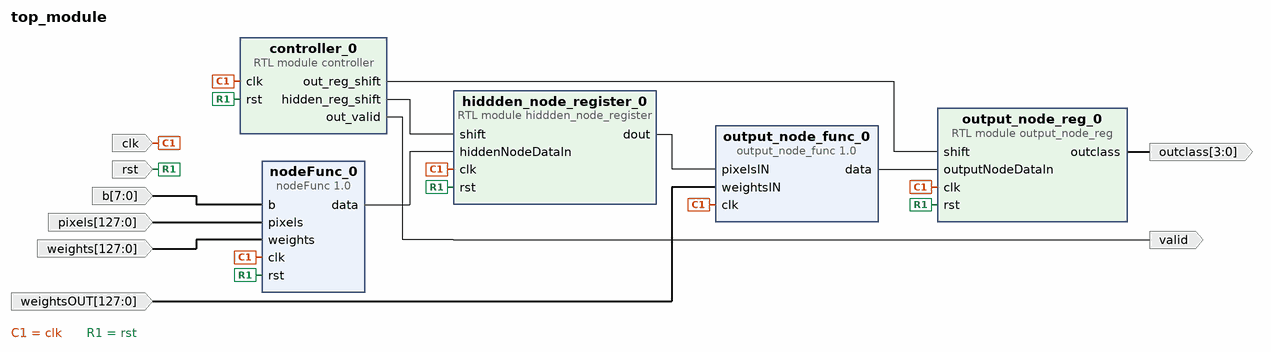
[diagram p0: block diagram of the top level]
# Vivado block design top_module, xc7a35tcpg236-1, Vivado 2022.2
create_bd_design top_module

create_bd_port -dir I -type clk clk
create_bd_port -dir I -type rst rst
create_bd_port -dir I -from 127 -to 0 weights
create_bd_port -dir I -from 127 -to 0 weightsOUT
create_bd_port -dir O valid
create_bd_port -dir O -from 3 -to 0 outclass
create_bd_port -dir I -from 7 -to 0 b
create_bd_port -dir I -from 127 -to 0 pixels

create_bd_cell -type ip -vlnv xilinx.com:user:nodeFunc:1.0 nodeFunc_0
create_bd_cell -type ip -vlnv xilinx.com:user:output_node_func:1.0 output_node_func_0
create_bd_cell -type module -reference controller controller_0
create_bd_cell -type module -reference hiddden_node_register hiddden_node_register_0
create_bd_cell -type module -reference output_node_reg output_node_reg_0

# ---- connections ----

connect_bd_net [get_bd_ports b] [get_bd_pins nodeFunc_0/b]
connect_bd_net -net clk_0_1 [get_bd_ports clk] \
  [get_bd_pins nodeFunc_0/clk] [get_bd_pins output_node_func_0/clk] [get_bd_pins controller_0/clk] \
  [get_bd_pins hiddden_node_register_0/clk] [get_bd_pins output_node_reg_0/clk]
connect_bd_net [get_bd_pins controller_0/hidden_reg_shift] [get_bd_pins hiddden_node_register_0/shift]
connect_bd_net [get_bd_pins controller_0/out_reg_shift] [get_bd_pins output_node_reg_0/shift]
connect_bd_net [get_bd_pins controller_0/out_valid] [get_bd_ports valid]
connect_bd_net [get_bd_pins hiddden_node_register_0/dout] [get_bd_pins output_node_func_0/pixelsIN]
connect_bd_net [get_bd_pins nodeFunc_0/data] [get_bd_pins hiddden_node_register_0/hiddenNodeDataIn]
connect_bd_net [get_bd_pins output_node_func_0/data] [get_bd_pins output_node_reg_0/outputNodeDataIn]
connect_bd_net [get_bd_pins output_node_reg_0/outclass] [get_bd_ports outclass]
connect_bd_net [get_bd_ports pixels] [get_bd_pins nodeFunc_0/pixels]
connect_bd_net -net rst_0_1 [get_bd_ports rst] \
  [get_bd_pins nodeFunc_0/rst] [get_bd_pins controller_0/rst] [get_bd_pins hiddden_node_register_0/rst] \
  [get_bd_pins output_node_reg_0/rst]
connect_bd_net [get_bd_ports weightsOUT] [get_bd_pins output_node_func_0/weightsIN]
connect_bd_net [get_bd_ports weights] [get_bd_pins nodeFunc_0/weights]

validate_bd_design
save_bd_design
